# EAGLE design output_8ch_spi_mux (EAGLE 9.2.1)

## Sheet 1 of 2
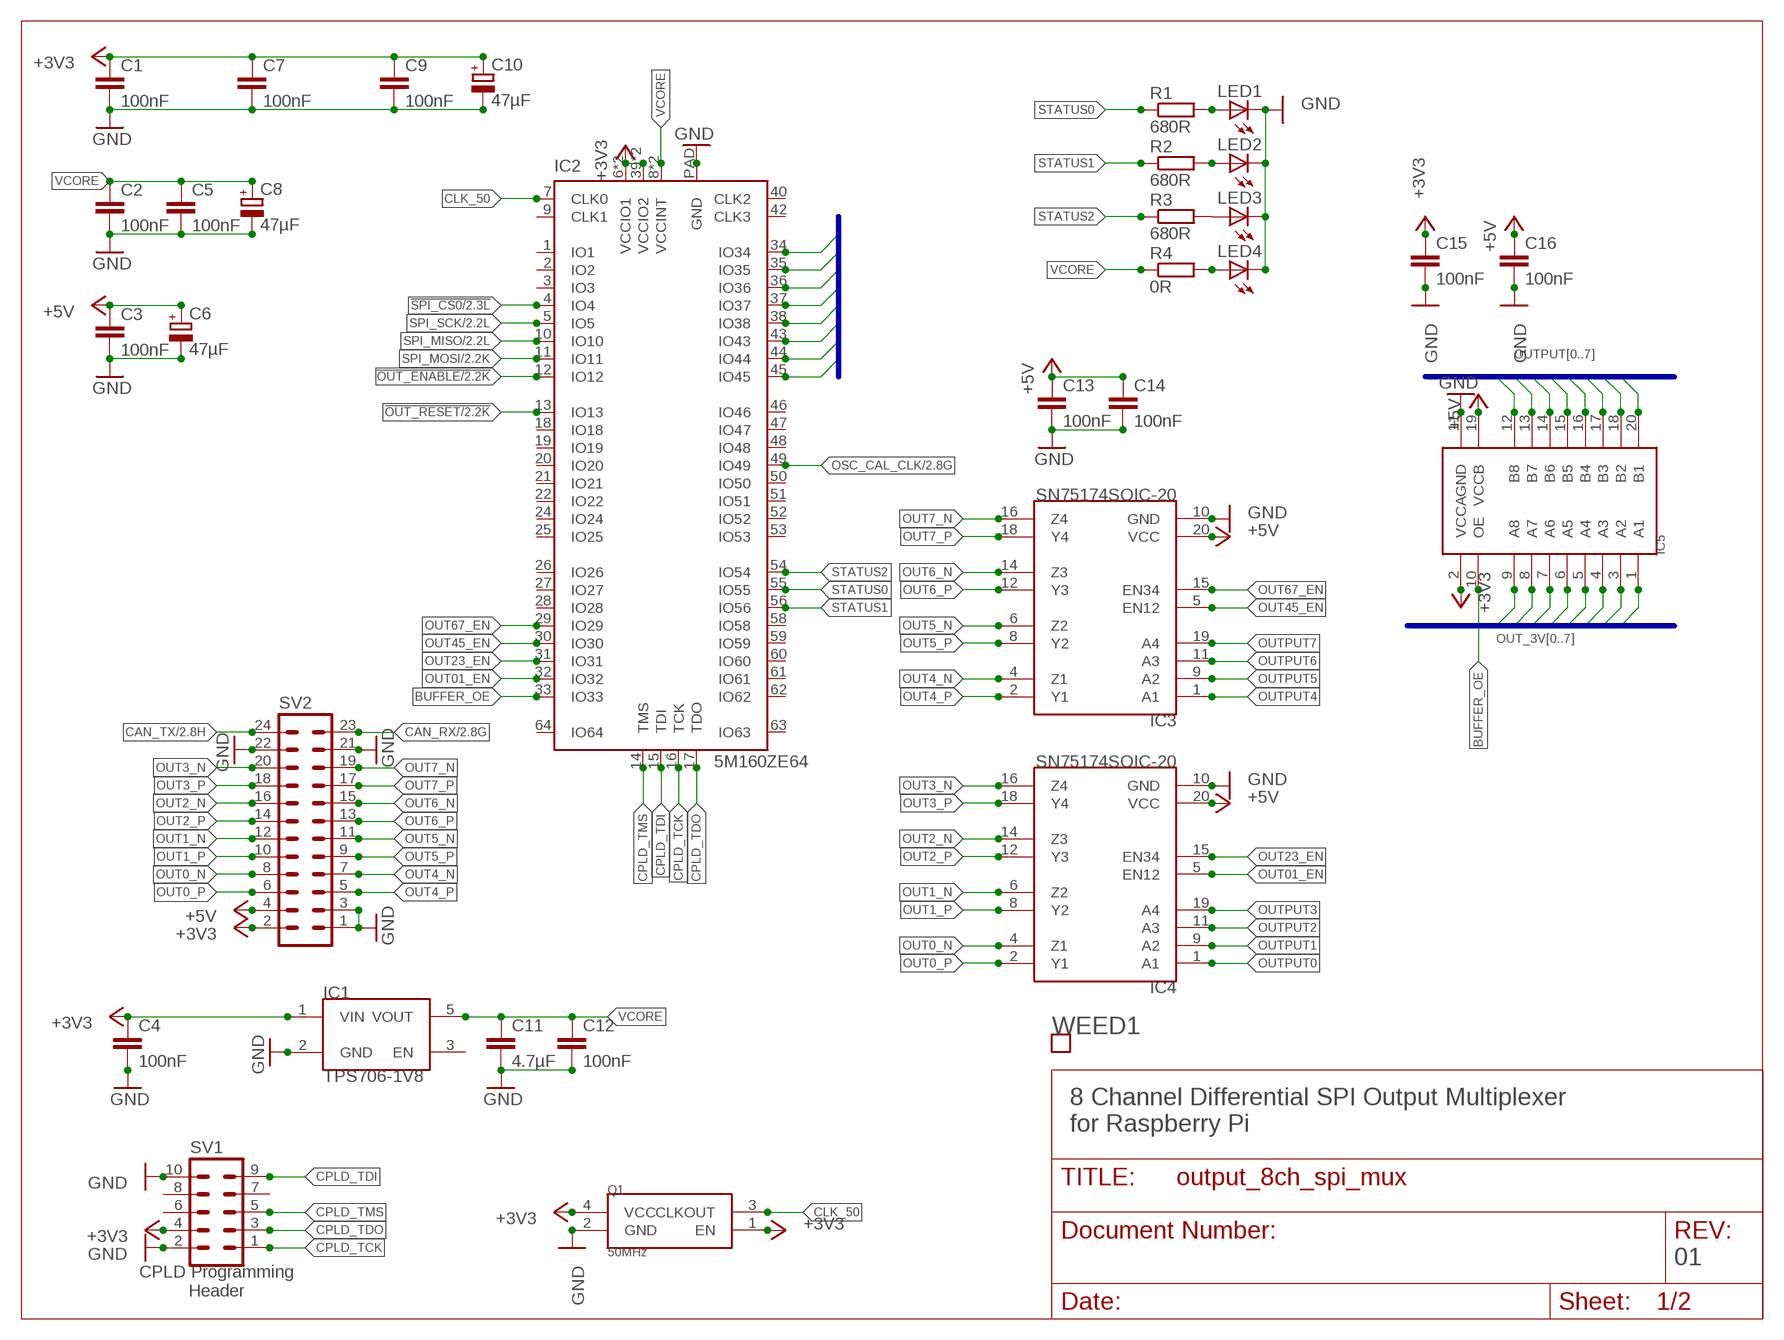
[diagram p0: schematic, sheet 1]

### Parts
C1  100nF  C-EUC0805  [C0805]
C2  100nF  C-EUC0805  [C0805]
C3  100nF  C-EUC0805  [C0805]
C4  100nF  C-EUC0805  [C0805]
C5  100nF  C-EUC0805  [C0805]
C6  47µF  CPOL-EUCT6032  [CT6032]
C7  100nF  C-EUC0805  [C0805]
C8  47µF  CPOL-EUCT6032  [CT6032]
C9  100nF  C-EUC0805  [C0805]
C10  47µF  CPOL-EUCT6032  [CT6032]
C11  4.7µF  C-EUC0805  [C0805]
C12  100nF  C-EUC0805  [C0805]
C13  100nF  C-EUC0805  [C0805]
C14  100nF  C-EUC0805  [C0805]
C15  100nF  C-EUC0805  [C0805]
C16  100nF  C-EUC0805  [C0805]
IC1  TPS706-1V8  TPS706SOT23-5  [SOT23-5]
IC2  5M160ZE64  [EQFP64]
IC3  SN75174SOIC-20  [SOIC20S]
IC4  SN75174SOIC-20  [SOIC20S]
IC5  TXB0108TSSOP20  [TSSOP20]
LED1  LEDCHIPLED_1206  [CHIPLED_1206]
LED2  LEDCHIPLED_1206  [CHIPLED_1206]
LED3  LEDCHIPLED_1206  [CHIPLED_1206]
LED4  LEDCHIPLED_1206  [CHIPLED_1206]
Q1  50MHz  DSC61XX  [VLGA-4]
R1  680R  R-EU_M0805  [M0805]
R2  680R  R-EU_M0805  [M0805]
R3  680R  R-EU_M0805  [M0805]
R4  0R  R-EU_M0805  [M0805]
SV1  MA05-2  [MA05-2]
SV2  MA12-2  [MA12-2]
WEED1  WEED  [DOINK]

### Nets
!OUT_ENABLE: IC2.12(IO12) ; also sheet 2
!OUT_RESET: IC2.13(IO13) ; also sheet 2
!SPI_CS0: IC2.4(IO4) ; also sheet 2
+3V3: C1.1 C4.1 C7.1 C9.1 C10.+ C15.1 IC1.1(VIN) IC2.6(VCCIO1) IC2.23(VCCIO1) IC2.39(VCCIO2) IC2.57(VCCIO2) IC5.2(VCCA) Q1.1(EN) Q1.4(VCC) SV1.4 SV2.2 ; also sheet 2
+5V: C3.1 C6.+ C13.1 C14.1 C16.1 IC3.20(VCC) IC4.20(VCC) IC5.19(VCCB) SV2.4 ; also sheet 2
BUFFER_OE: IC2.33(IO33) IC5.10(OE)
CAN_RX: SV2.23 ; also sheet 2
CAN_TX: SV2.24 ; also sheet 2
CLK_50: IC2.7(CLK0) Q1.3(CLKOUT)
CPLD_TCK: IC2.16(TCK) SV1.1
CPLD_TDI: IC2.15(TDI) SV1.9
CPLD_TDO: IC2.17(TDO) SV1.3
CPLD_TMS: IC2.14(TMS) SV1.5
GND: C1.2 C2.2 C3.2 C4.2 C5.2 C6.- C7.2 C8.- C9.2 C10.- C11.2 C12.2 C13.2 C14.2 C15.2 C16.2 IC1.2(GND) IC2.PAD(GND) IC3.10(GND) IC4.10(GND) IC5.11(GND) LED1.C LED2.C LED3.C LED4.C Q1.2(GND) SV1.2 SV1.10 SV2.1 SV2.3 SV2.21 SV2.22 ; also sheet 2
N$1: LED4.A R4.2
N$2: LED3.A R3.2
N$13: LED1.A R1.2
N$14: LED2.A R2.2
OSC_CAL_CLK: IC2.49(IO49) ; also sheet 2
OUT0_N: IC4.4(Z1) SV2.8
OUT0_P: IC4.2(Y1) SV2.6
OUT01_EN: IC2.32(IO32) IC4.5(EN12)
OUT1_N: IC4.6(Z2) SV2.12
OUT1_P: IC4.8(Y2) SV2.10
OUT2_N: IC4.14(Z3) SV2.16
OUT2_P: IC4.12(Y3) SV2.14
OUT3_N: IC4.16(Z4) SV2.20
OUT3_P: IC4.18(Y4) SV2.18
OUT4_N: IC3.4(Z1) SV2.7
OUT4_P: IC3.2(Y1) SV2.5
OUT5_N: IC3.6(Z2) SV2.11
OUT5_P: IC3.8(Y2) SV2.9
OUT6_N: IC3.14(Z3) SV2.15
OUT6_P: IC3.12(Y3) SV2.13
OUT7_N: IC3.16(Z4) SV2.19
OUT7_P: IC3.18(Y4) SV2.17
OUT23_EN: IC2.31(IO31) IC4.15(EN34)
OUT45_EN: IC2.30(IO30) IC3.5(EN12)
OUT67_EN: IC2.29(IO29) IC3.15(EN34)
OUT_3V0: IC2.45(IO45) IC5.1(A1)
OUT_3V1: IC2.44(IO44) IC5.3(A2)
OUT_3V2: IC2.43(IO43) IC5.4(A3)
OUT_3V3: IC2.38(IO38) IC5.5(A4)
OUT_3V4: IC2.37(IO37) IC5.6(A5)
OUT_3V5: IC2.36(IO36) IC5.7(A6)
OUT_3V6: IC2.35(IO35) IC5.8(A7)
OUT_3V7: IC2.34(IO34) IC5.9(A8)
OUTPUT0: IC4.1(A1) IC5.20(B1)
OUTPUT1: IC4.9(A2) IC5.18(B2)
OUTPUT2: IC4.11(A3) IC5.17(B3)
OUTPUT3: IC4.19(A4) IC5.16(B4)
OUTPUT4: IC3.1(A1) IC5.15(B5)
OUTPUT5: IC3.9(A2) IC5.14(B6)
OUTPUT6: IC3.11(A3) IC5.13(B7)
OUTPUT7: IC3.19(A4) IC5.12(B8)
SPI_MISO: IC2.10(IO10) ; also sheet 2
SPI_MOSI: IC2.11(IO11) ; also sheet 2
SPI_SCK: IC2.5(IO5) ; also sheet 2
STATUS0: IC2.55(IO55) R1.1
STATUS1: IC2.56(IO56) R2.1
STATUS2: IC2.54(IO54) R3.1
VCORE: C2.1 C5.1 C8.+ C11.1 C12.1 IC1.5(VOUT) IC2.8(VCCINT) IC2.41(VCCINT) R4.1
Unconnected: IC1.3(EN) IC2.1(IO1) IC2.2(IO2) IC2.3(IO3) IC2.9(CLK1) IC2.18(IO18) IC2.19(IO19) IC2.20(IO20) IC2.21(IO21) IC2.22(IO22) IC2.24(IO24) IC2.25(IO25) IC2.26(IO26) IC2.27(IO27) IC2.28(IO28) IC2.40(CLK2) IC2.42(CLK3) IC2.46(IO46) IC2.47(IO47) IC2.48(IO48) IC2.50(IO50) IC2.51(IO51) IC2.52(IO52) IC2.53(IO53) IC2.58(IO58) IC2.59(IO59) IC2.60(IO60) IC2.61(IO61) IC2.62(IO62) IC2.63(IO63) IC2.64(IO64) SV1.6 SV1.7 SV1.8

### Buses
OUT_3V[0..7]
OUTPUT[0..7]

### Notes on the sheet
- 8 Channel Differential SPI Output Multiplexer
  for Raspberry Pi
- CPLD Programming
  Header
- 01

## Sheet 2 of 2
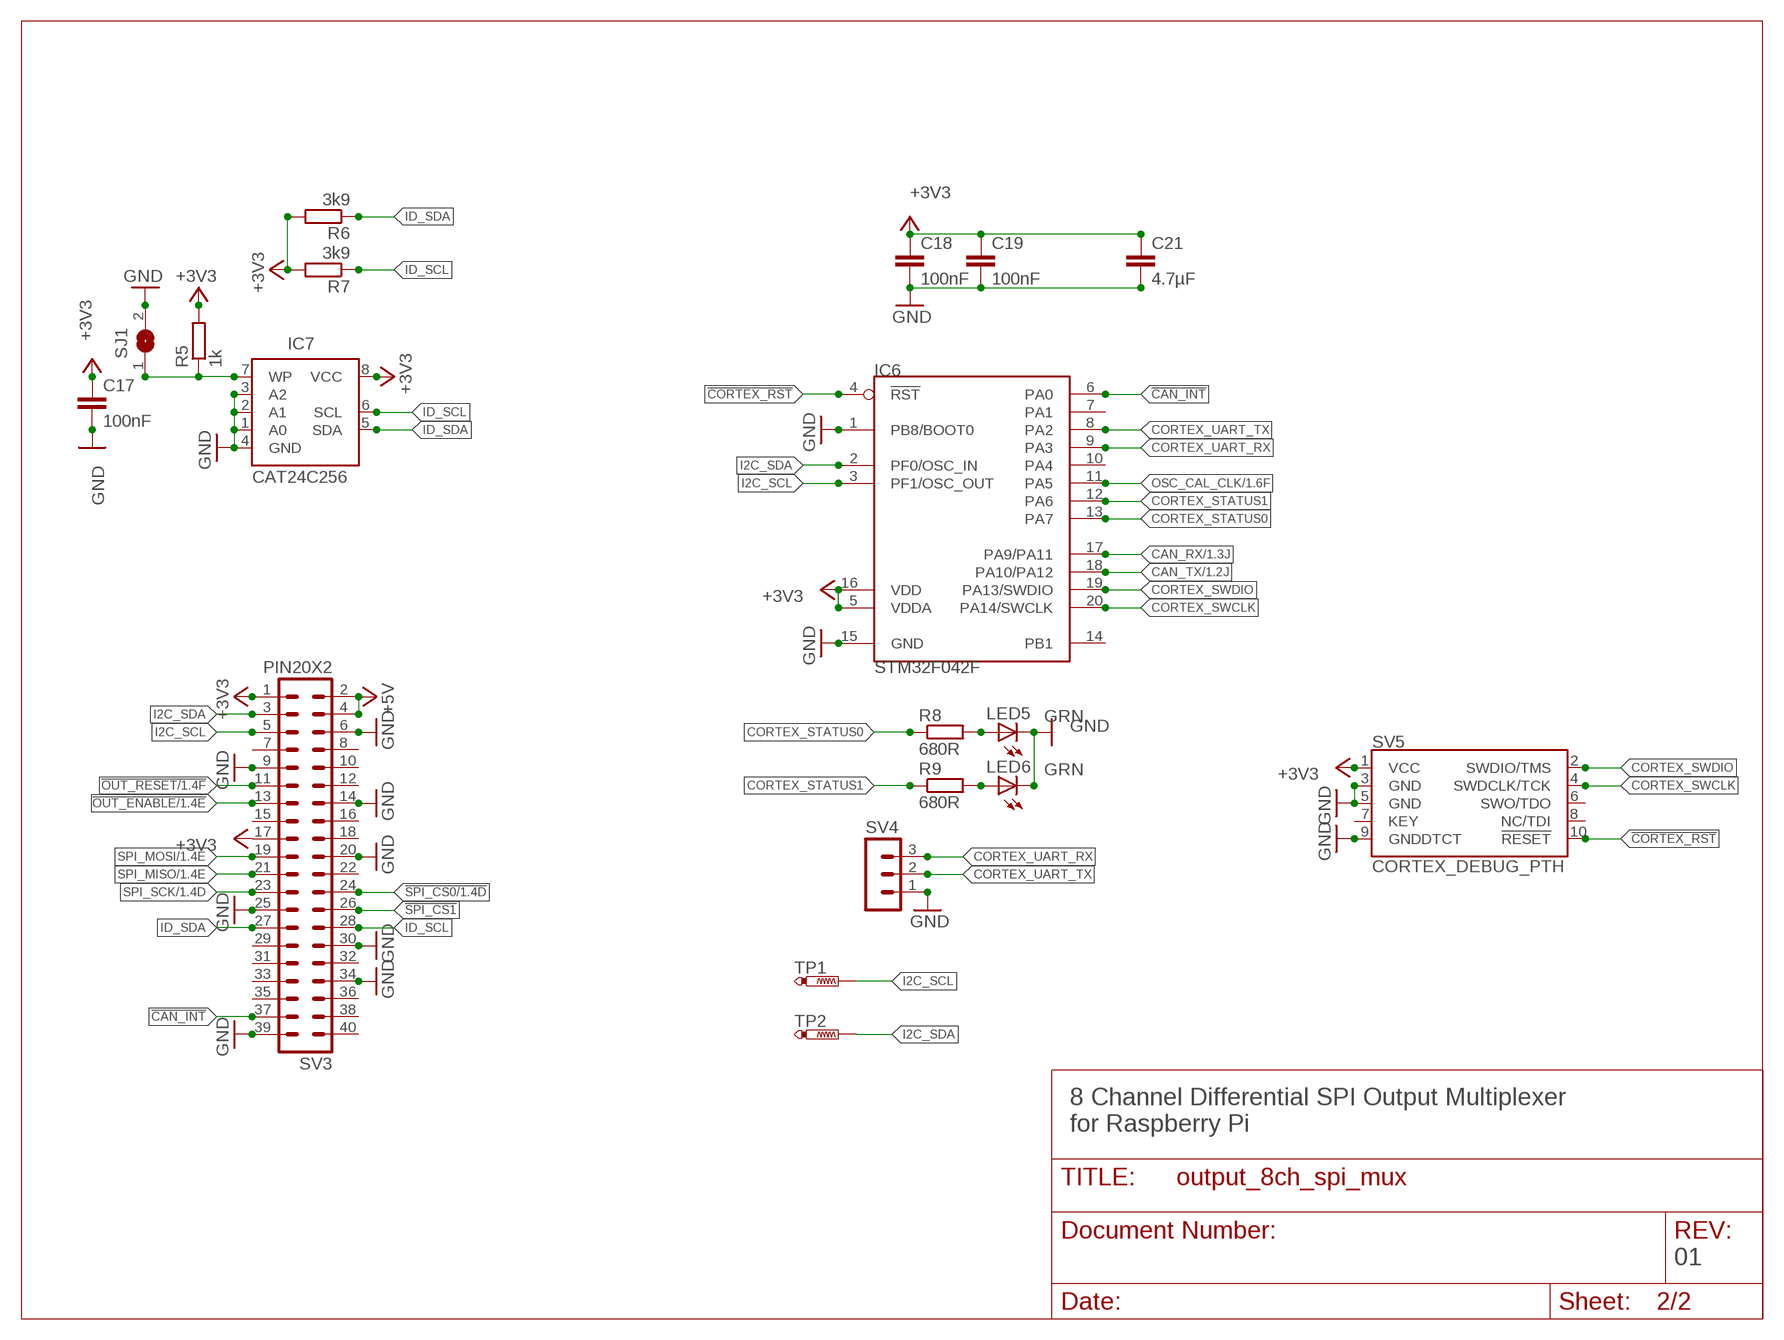
[diagram p1: schematic, sheet 2]

### Parts
C17  100nF  C-EUC0805  [C0805]
C18  100nF  C-EUC0805  [C0805]
C19  100nF  C-EUC0805  [C0805]
C21  4.7µF  C-EUC0805  [C0805]
IC6  STM32F042F  [TSSOP20]
IC7  CAT24C256  EEPROM24  [SOIC8]
LED5  GRN  LEDCHIPLED_1206  [CHIPLED_1206]
LED6  GRN  LEDCHIPLED_1206  [CHIPLED_1206]
R5  1k  R-EU_M0805  [M0805]
R6  3k9  R-EU_M0805  [M0805]
R7  3k9  R-EU_M0805  [M0805]
R8  680R  R-EU_M0805  [M0805]
R9  680R  R-EU_M0805  [M0805]
SJ1  SJ  [SJ]
SV3  PIN20X2  [PIN_20X2]
SV4  MA03-1  [MA03-1]
SV5  CORTEX_DEBUG_PTH  [2X5-PTH-1.27MM]
TP1  PTR1B1,27  [B1,27]
TP2  PTR1B1,27  [B1,27]

### Nets
!CAN_INT: IC6.6(PA0) SV3.37
!CORTEX_RST: IC6.4(!RST) SV5.10(!RESET)
!OUT_ENABLE: SV3.13 ; also sheet 1
!OUT_RESET: SV3.11 ; also sheet 1
!SPI_CS0: SV3.24 ; also sheet 1
!SPI_CS1: SV3.26
+3V3: C17.1 C18.1 C19.1 C21.1 IC6.5(VDDA) IC6.16(VDD) IC7.8(VCC) R5.2 R6.2 R7.2 SV3.1 SV3.17 SV5.1(VCC) ; also sheet 1
+5V: SV3.2 SV3.4 ; also sheet 1
CAN_RX: IC6.17(PA9/PA11) ; also sheet 1
CAN_TX: IC6.18(PA10/PA12) ; also sheet 1
CORTEX_STATUS0: IC6.13(PA7) R8.1
CORTEX_STATUS1: IC6.12(PA6) R9.1
CORTEX_SWCLK: IC6.20(PA14/SWCLK) SV5.4(SWDCLK/TCK)
CORTEX_SWDIO: IC6.19(PA13/SWDIO) SV5.2(SWDIO/TMS)
CORTEX_UART_RX: IC6.9(PA3) SV4.3
CORTEX_UART_TX: IC6.8(PA2) SV4.2
GND: C17.2 C18.2 C19.2 C21.2 IC6.1(PB8/BOOT0) IC6.15(GND) IC7.1(A0) IC7.2(A1) IC7.3(A2) IC7.4(GND) LED5.C LED6.C SJ1.2 SV3.6 SV3.9 SV3.14 SV3.20 SV3.25 SV3.30 SV3.34 SV3.39 SV4.1 SV5.3(GND) SV5.5(GND) SV5.9(GNDDTCT) ; also sheet 1
I2C_SCL: IC6.3(PF1/OSC_OUT) SV3.5 TP1.TP
I2C_SDA: IC6.2(PF0/OSC_IN) SV3.3 TP2.TP
ID_SCL: IC7.6(SCL) R7.1 SV3.28
ID_SDA: IC7.5(SDA) R6.1 SV3.27
N$3: IC7.7(WP) R5.1 SJ1.1
N$4: LED5.A R8.2
N$5: LED6.A R9.2
OSC_CAL_CLK: IC6.11(PA5) ; also sheet 1
SPI_MISO: SV3.21 ; also sheet 1
SPI_MOSI: SV3.19 ; also sheet 1
SPI_SCK: SV3.23 ; also sheet 1
Unconnected: IC6.7(PA1) IC6.10(PA4) IC6.14(PB1) SV3.7 SV3.8 SV3.10 SV3.12 SV3.15 SV3.16 SV3.18 SV3.22 SV3.29 SV3.31 SV3.32 SV3.33 SV3.35 SV3.36 SV3.38 SV3.40 SV5.6(SWO/TDO) SV5.7(KEY) SV5.8(NC/TDI)

### Notes on the sheet
- 8 Channel Differential SPI Output Multiplexer
  for Raspberry Pi
- 01

## Library data of the parts
C1-C5 C7 C9 C12-C19 = rcl:C-EU: CAPACITOR, European symbol; MOUSER: 710-885012207072; SPICEPREFIX: C
C6 C8 C10 = rcl:CPOL-EU: POLARIZED CAPACITOR, European symbol; MOUSER: 581-TAJD476M016RNJV; SPICEPREFIX: C
C11 C21 = rcl:C-EU: CAPACITOR, European symbol; MOUSER: 81-GRM21BR71A475ME1L; SPICEPREFIX: C
IC1 = lichtenstein_onion:TPS706: 1.8V Out, 150-mA, 1-μA IQ Voltage Regulators with Enable Information <http://www.ti.com/product/tps706>; MOUSER: 595-TPS70618DBVT
IC2 = lichtenstein_onion:5M160ZE64: 5M160ZE64 edit this description Auto generated by make-symbol-device-package-bsdl.ulp Rev. 44 Source: 5M160ZE64.bsd; MOUSER: 989-5M160ZE64C5N
IC3 IC4 = lichtenstein_onion:SN75174: Quadruple Differential Line Driver Datasheet <http://www.ti.com/lit/ds/symlink/sn75174.pdf>; MOUSER: 595-SN75174DWR
IC5 = lichtenstein_onion:TXB0108: 8-Bit Bidirectional Voltage-Level Translator with Auto-Direction Sensing and ±15-kV ESD Protection Footprint Proven Datasheet <http://www.ti.com/lit/ds/symlink/txb0108.pdf>; MOUSER: 595-TXB0108PWR
IC6 = lichtenstein_onion:STM32F042F: STM32F042Fx – Mainstream ARM Cortex-M0 USB line MCU with 32 Kbytes Flash, 48 MHz CPU, USB, CAN and CEC functions Datasheet <https://www.st.com/resource/en/datasheet/stm32f042f6.pdf> STM32F042x6 <https://www.st.com/content/st_com/en/products/microcontrollers/stm32-32-bit-arm-cortex-mcus/stm32-mainstream-mcus/stm32f0-series/stm32f0x2/stm32f042f6.html>: 32K flash, 6K SRAM STM32F042x4 <https://www.st.com/content/st_com/en/products/microcontrollers/stm32-32-bit-arm-cortex-mcus/stm32-mainstream-mcus/stm32f0-series/stm32f0x2/stm32f042f4.html>: 16K flash, 6K SRAM; MOUSER: 511-STM32F042F6P6
IC7 = FLYFISH:EEPROM24; MOUSER: 698-CAT24C256WI-GT3
LED1-LED3 LED5 LED6 = led:LED: LED OSRAM: - CHIPLED LG R971, LG N971, LY N971, LG Q971, LY Q971, LO R971, LY R971 LH N974, LH R974 LS Q976, LO Q976, LY Q976 LO Q996 - Hyper CHIPLED LW Q18S LB Q993, LB Q99A, LB R99A - SideLED LS A670, LO A670, LY A670, LG A670, LP A670 LB A673, LV A673, LT A673, LW A673 LH A674 LY A675 LS A676, LA A676, LO A676, LY A676, LW A676 LS A679, LY A679, LG A679 - Hyper Micro SIDELED® LS Y876, LA Y876, LO Y876, LY Y876 LT Y87S - SmartLED LW L88C, LW L88S LB L89C, LB L89S, LG L890 LS L89K, LO L89K, LY L89K LS L896, LA L896, LO L896, LY L896 - TOPLED LS T670, LO T670, LY T670, LG T670, LP T670 LSG T670, LSP T670, LSY T670, LOP T670, LYG T670 LG T671, LOG T671, LSG T671 LB T673, LV T673, LT T673, LW T673 LH T674 LS T676, LA T676, LO T676, LY T676, LB T676, LH T676, LSB T676, LW T676 LB T67C, LV T67C, LT T67C, LS T67K, LO T67K, LY T67K, LW E67C LS E67B, LA E67B, LO E67B, LY E67B, LB E67C, LV E67C, LT E67C LW T67C LS T679, LY T679, LG T679 LS T770, LO T770, LY T770, LG T770, LP T770 LB T773, LV T773, LT T773, LW T773 LH T774 LS E675, LA E675, LY E675, LS T675 LS T776, LA T776, LO T776, LY T776, LB T776 LHGB T686 LT T68C, LB T68C - Hyper Mini TOPLED® LB M676 - Mini TOPLED Santana® LG M470 LS M47K, LO M47K, LY M47K Source: http://www.osram.convergy.de LUXEON: - LUMILED® LXK2-PW12-R00, LXK2-PW12-S00, LXK2-PW14-U00, LXK2-PW14-V00 LXK2-PM12-R00, LXK2-PM12-S00, LXK2-PM14-U00 LXK2-PE12-Q00, LXK2-PE12-R00, LXK2-PE12-S00, LXK2-PE14-T00, LXK2-PE14-U00 LXK2-PB12-K00, LXK2-PB12-L00, LXK2-PB12-M00, LXK2-PB14-N00, LXK2-PB14-P00, LXK2-PB14-Q00 LXK2-PR12-L00, LXK2-PR12-M00, LXK2-PR14-Q00, LXK2-PR14-R00 LXK2-PD12-Q00, LXK2-PD12-R00, LXK2-PD12-S00 LXK2-PH12-R00, LXK2-PH12-S00 LXK2-PL12-P00, LXK2-PL12-Q00, LXK2-PL12-R00 Source: www.luxeon.com KINGBRIGHT: KA-3528ASYC Source: www.kingbright.com; MOUSER: 604-APTR3216SGC
LED4 = led:LED: LED OSRAM: - CHIPLED LG R971, LG N971, LY N971, LG Q971, LY Q971, LO R971, LY R971 LH N974, LH R974 LS Q976, LO Q976, LY Q976 LO Q996 - Hyper CHIPLED LW Q18S LB Q993, LB Q99A, LB R99A - SideLED LS A670, LO A670, LY A670, LG A670, LP A670 LB A673, LV A673, LT A673, LW A673 LH A674 LY A675 LS A676, LA A676, LO A676, LY A676, LW A676 LS A679, LY A679, LG A679 - Hyper Micro SIDELED® LS Y876, LA Y876, LO Y876, LY Y876 LT Y87S - SmartLED LW L88C, LW L88S LB L89C, LB L89S, LG L890 LS L89K, LO L89K, LY L89K LS L896, LA L896, LO L896, LY L896 - TOPLED LS T670, LO T670, LY T670, LG T670, LP T670 LSG T670, LSP T670, LSY T670, LOP T670, LYG T670 LG T671, LOG T671, LSG T671 LB T673, LV T673, LT T673, LW T673 LH T674 LS T676, LA T676, LO T676, LY T676, LB T676, LH T676, LSB T676, LW T676 LB T67C, LV T67C, LT T67C, LS T67K, LO T67K, LY T67K, LW E67C LS E67B, LA E67B, LO E67B, LY E67B, LB E67C, LV E67C, LT E67C LW T67C LS T679, LY T679, LG T679 LS T770, LO T770, LY T770, LG T770, LP T770 LB T773, LV T773, LT T773, LW T773 LH T774 LS E675, LA E675, LY E675, LS T675 LS T776, LA T776, LO T776, LY T776, LB T776 LHGB T686 LT T68C, LB T68C - Hyper Mini TOPLED® LB M676 - Mini TOPLED Santana® LG M470 LS M47K, LO M47K, LY M47K Source: http://www.osram.convergy.de LUXEON: - LUMILED® LXK2-PW12-R00, LXK2-PW12-S00, LXK2-PW14-U00, LXK2-PW14-V00 LXK2-PM12-R00, LXK2-PM12-S00, LXK2-PM14-U00 LXK2-PE12-Q00, LXK2-PE12-R00, LXK2-PE12-S00, LXK2-PE14-T00, LXK2-PE14-U00 LXK2-PB12-K00, LXK2-PB12-L00, LXK2-PB12-M00, LXK2-PB14-N00, LXK2-PB14-P00, LXK2-PB14-Q00 LXK2-PR12-L00, LXK2-PR12-M00, LXK2-PR14-Q00, LXK2-PR14-R00 LXK2-PD12-Q00, LXK2-PD12-R00, LXK2-PD12-S00 LXK2-PH12-R00, LXK2-PH12-S00 LXK2-PL12-P00, LXK2-PL12-Q00, LXK2-PL12-R00 Source: www.luxeon.com KINGBRIGHT: KA-3528ASYC Source: www.kingbright.com; MOUSER: 604-APT3216LSECKJ3RV
Q1 = lichtenstein_onion:DSC61XX: Ultra-Small, Ultra-Low Power MEMS Oscillator Footprint Proven Datasheet <https://www.mouser.com/datasheet/2/268/20005624B-1149202.pdf>; MOUSER: 579-6101JI2A0500000T
R1-R3 R8 R9 = rcl:R-EU_: RESISTOR, European symbol; MOUSER: 652-CR0805-FX6800GLF; SPICEPREFIX: R
R4 = rcl:R-EU_: RESISTOR, European symbol; MOUSER: 71-RCG08050000Z0EA; SPICEPREFIX: R
R5 = rcl:R-EU_: RESISTOR, European symbol; MOUSER: 667-ERJ-6ENF1001V; SPICEPREFIX: R
R6 R7 = rcl:R-EU_: RESISTOR, European symbol; MOUSER: 667-ERJ-6ENF3901V; SPICEPREFIX: R
SJ1 = jumper:SJ: SMD solder JUMPER
SV1 = con-lstb:MA05-2: PIN HEADER; MOUSER: 517-30310-6002; OC_FARNELL: unknown; OC_NEWARK: unknown
SV2 = con-lstb:MA12-2: PIN HEADER; MOUSER: 517-30320-6002; OC_FARNELL: unknown; OC_NEWARK: unknown
SV3 = FLYFISH:PIN20X2
SV4 = con-lstb:MA03-1: PIN HEADER; OC_FARNELL: unknown; OC_NEWARK: unknown
SV5 = lichtenstein_onion:CORTEX_DEBUG: Cortex Debug Connector - 10 pin; MOUSER: 649-221111-00010T4LF
TP1 TP2 = testpad:PTR1: TEST PIN
WEED1 = lichtenstein_onion:WEED

## Board
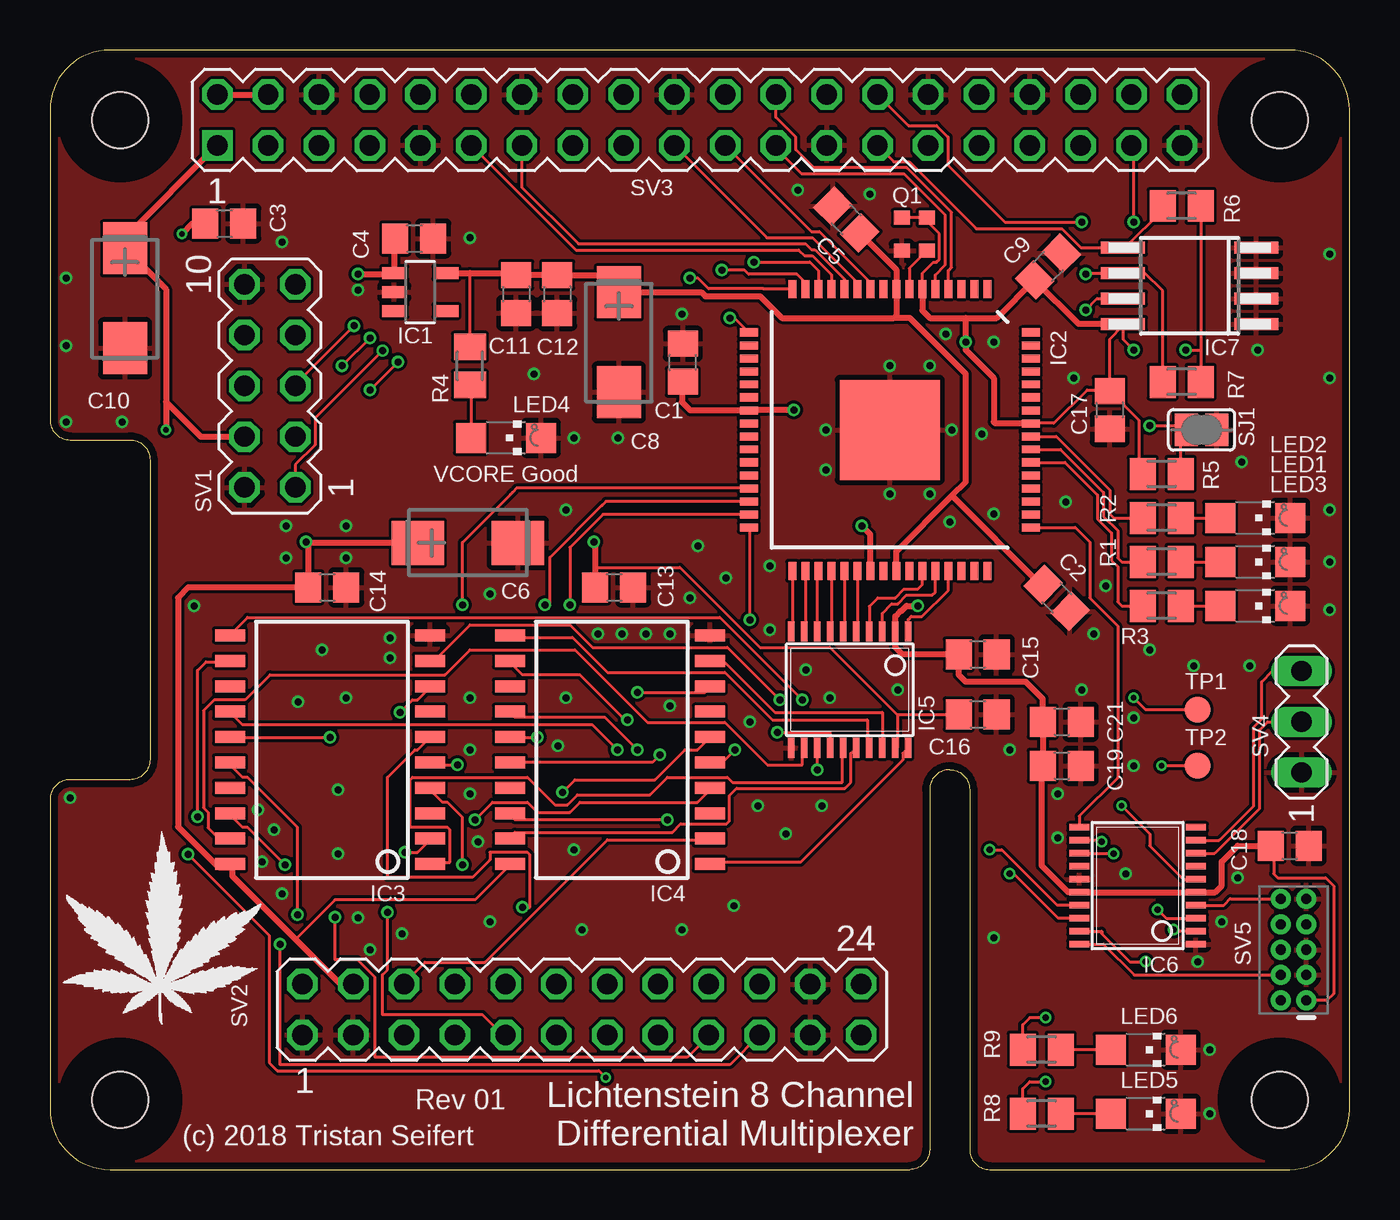
[diagram p2: board, top side]
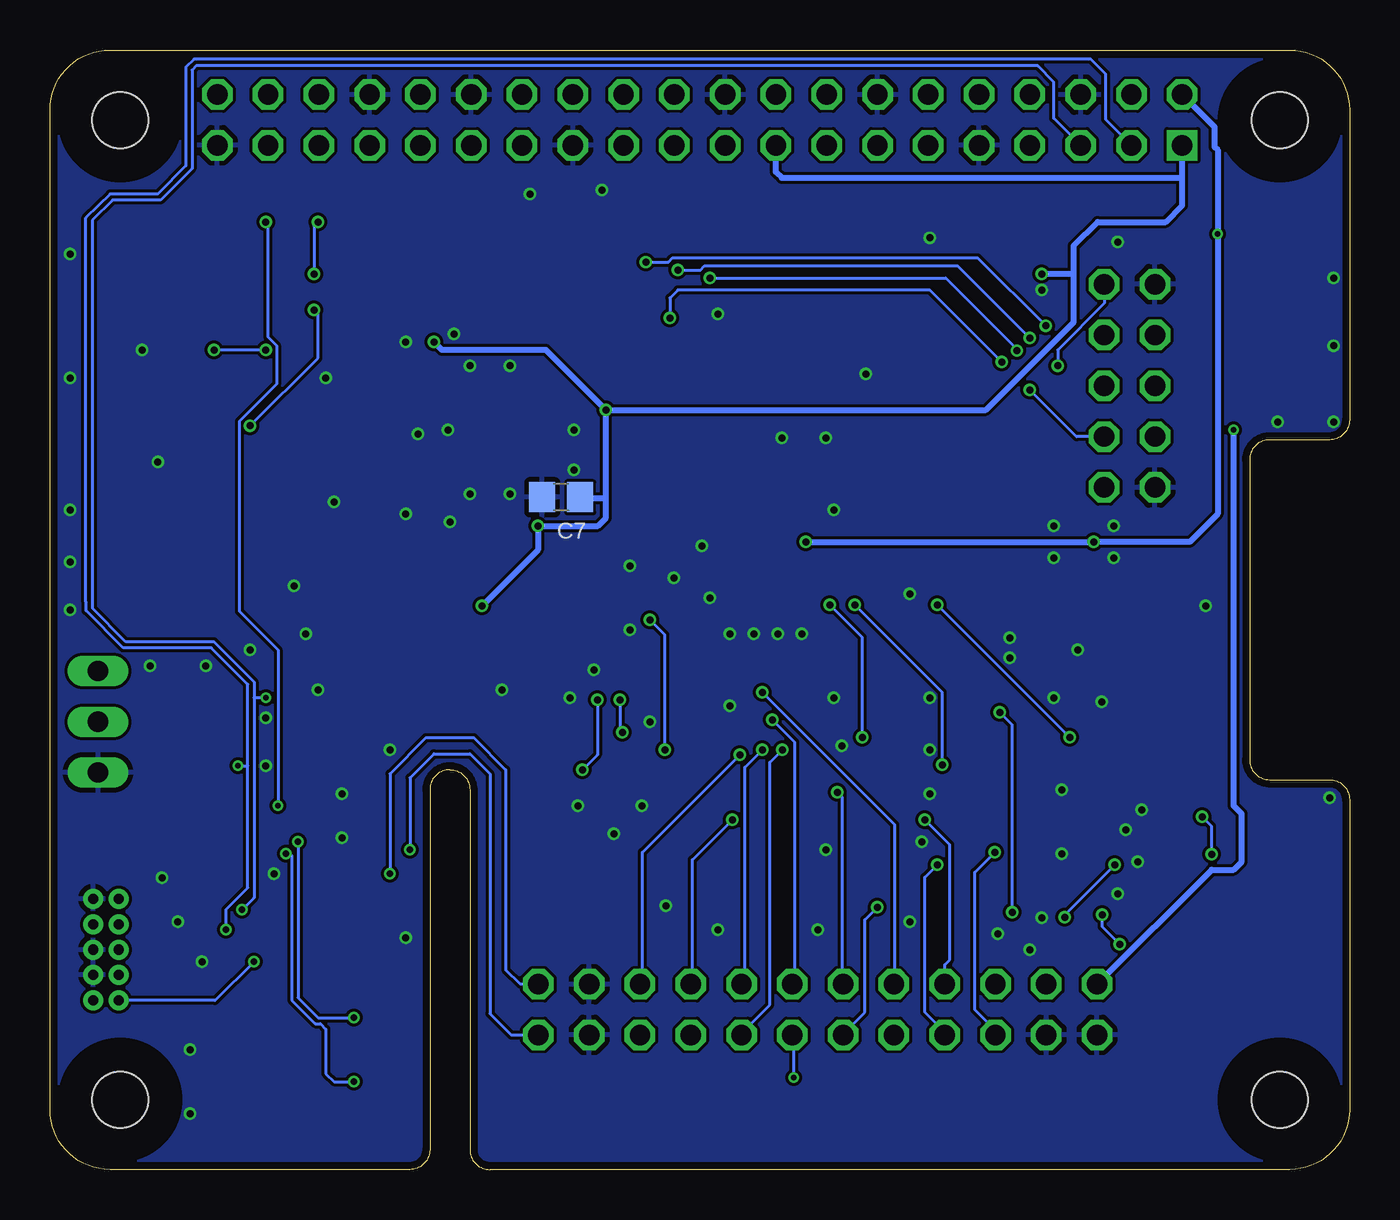
[diagram p3: board, bottom side, seen from below]

Size 65 x 56 mm. Coordinates in mm from the lower left corner, seen from the top.
Outline: 0,3 arc90 3,0 43,0 arc90 44,1 44,19 arc-90 45,20 arc-90 46,19 46,1 arc90 47,0 62,0 arc90 65,3 65,53 arc90 62,56 3,56 arc90 0,53 0,37.5 arc90 1,36.5 4,36.5 arc-90 5,35.5 5,20.5 arc-90 4,19.5 1,19.5 arc90 0,18.5 0,3
Copper layers (1*16): Top 0.035559375mm / dielectric 1.6mm / Bottom 0.035559375mm
Design rules "oshpark-2layer *": minimum track width 6mil, minimum drill 10mil, track to track 6mil, track to pad 6mil, pad to pad 6mil, via to via 6mil, smd to smd 6mil, copper to edge 15mil, drill to drill 6mil, minimum pad ring 5mil, minimum via ring 5mil, stop-mask expansion 2.5mil, vias tented up to drill 0mil, thermal gap 10mil
Holes 2.8 mm at 3.5,3.5 3.5,52.5 61.5,52.5 61.5,3.5
tRestrict: area 1.9,51 to 5,54; area 60,51 to 63,54; area 60,1.9 to 63,5; area 1.9,1.9 to 5,5
bRestrict: area 1.9,1.9 to 5,5; area 1.9,51 to 5,54; area 60,1.9 to 63,5; area 60,51 to 63,54

### Footprints (pad centres in the part's own frame; a part is rotated, then mirrored left to right if it is on the bottom)
C0805 = smd 1.3 x 1.5: 1 -0.95,0; 2 0.95,0
CT6032 = smd 2.6 x 2.2: + -2.5,0; - 2.5,0
SOT23-5 = smd 0.6 x 1.2: 1 -0.95,-1.306; 2 0,-1.306; 3 0.95,-1.306; 4 0.95,1.306; 5 -0.95,1.306
EQFP64 = smd 0.9 x 0.4: 1 -7.05,4.875; 2 -7.05,4.225; 3 -7.05,3.575; 4 -7.05,2.925; 5 -7.05,2.275; 6 -7.05,1.625; 7 -7.05,0.975; 8 -7.05,0.325; 9 -7.05,-0.325; 10 -7.05,-0.975; 11 -7.05,-1.625; 12 -7.05,-2.275; 13 -7.05,-2.925; 14 -7.05,-3.575; 15 -7.05,-4.225; 16 -7.05,-4.875; 33 7.05,-4.875; 34 7.05,-4.225; 35 7.05,-3.575; 36 7.05,-2.925; 37 7.05,-2.275; 38 7.05,-1.625; 39 7.05,-0.975; 40 7.05,-0.325; 41 7.05,0.325; 42 7.05,0.975; 43 7.05,1.625; 44 7.05,2.275; 45 7.05,2.925; 46 7.05,3.575; 47 7.05,4.225; 48 7.05,4.875 | smd 0.4 x 0.9: 17 -4.875,-7.05; 18 -4.225,-7.05; 19 -3.575,-7.05; 20 -2.925,-7.05; 21 -2.275,-7.05; 22 -1.625,-7.05; 23 -0.975,-7.05; 24 -0.325,-7.05; 25 0.325,-7.05; 26 0.975,-7.05; 27 1.625,-7.05; 28 2.275,-7.05; 29 2.925,-7.05; 30 3.575,-7.05; 31 4.225,-7.05; 32 4.875,-7.05; 49 4.875,7.05; 50 4.225,7.05; 51 3.575,7.05; 52 2.925,7.05; 53 2.275,7.05; 54 1.625,7.05; 55 0.975,7.05; 56 0.325,7.05; 57 -0.325,7.05; 58 -0.975,7.05; 59 -1.625,7.05; 60 -2.275,7.05; 61 -2.925,7.05; 62 -3.575,7.05; 63 -4.225,7.05; 64 -4.875,7.05 | smd 5 x 5: PAD 0,0
SOIC20S = smd 0.6 x 1.5: 1 -5.715,-5; 2 -4.445,-5; 3 -3.175,-5; 4 -1.905,-5; 5 -0.635,-5; 6 0.635,-5; 7 1.905,-5; 8 3.175,-5; 9 4.445,-5; 10 5.715,-5; 11 5.715,5; 12 4.445,5; 13 3.175,5; 14 1.905,5; 15 0.635,5; 16 -0.635,5; 17 -1.905,5; 18 -3.175,5; 19 -4.445,5; 20 -5.715,5
TSSOP20 = smd 0.305 x 0.991: 1 -2.925,-2.918; 2 -2.275,-2.918; 3 -1.625,-2.918; 4 -0.975,-2.918; 5 -0.325,-2.918; 6 0.325,-2.918; 7 0.975,-2.918; 8 1.625,-2.918; 9 2.275,-2.918; 10 2.925,-2.918; 11 2.925,2.918; 12 2.275,2.918; 13 1.625,2.918; 14 0.975,2.918; 15 0.325,2.918; 16 -0.325,2.918; 17 -0.975,2.918; 18 -1.625,2.918; 19 -2.275,2.918; 20 -2.925,2.918
SOIC8 = smd 0.6 x 2.2: 1 -1.905,-3.33; 2 -0.635,-3.33; 3 0.635,-3.33; 4 1.905,-3.33; 5 1.905,3.33; 6 0.635,3.33; 7 -0.635,3.33; 8 -1.905,3.33
CHIPLED_1206 = smd 1.5 x 1.5: A 0,-1.75; C 0,1.75
VLGA-4 = smd 0.7 x 0.8: 1 0,-1.25; 2 1.65,-1.25; 3 1.65,0; 4 0,0
M0805 = smd 1.3 x 1.6: 1 -0.95,0; 2 0.95,0
SJ = smd 1.168 x 1.6: 1 -0.762,0; 2 0.762,0
MA05-2 = drill 1.016 octagon: 1 -5.08,-1.27; 2 -5.08,1.27; 3 -2.54,-1.27; 4 -2.54,1.27; 5 0,-1.27; 6 0,1.27; 7 2.54,-1.27; 8 2.54,1.27; 9 5.08,-1.27; 10 5.08,1.27
MA12-2 = drill 1.016 octagon: 1 -13.97,-1.27; 2 -13.97,1.27; 3 -11.43,-1.27; 4 -11.43,1.27; 5 -8.89,-1.27; 6 -8.89,1.27; 7 -6.35,-1.27; 8 -6.35,1.27; 9 -3.81,-1.27; 10 -3.81,1.27; 11 -1.27,-1.27; 12 -1.27,1.27; 13 1.27,-1.27; 14 1.27,1.27; 15 3.81,-1.27; 16 3.81,1.27; 17 6.35,-1.27; 18 6.35,1.27; 19 8.89,-1.27; 20 8.89,1.27; 21 11.43,-1.27; 22 11.43,1.27; 23 13.97,-1.27; 24 13.97,1.27
PIN_20X2 = drill 1.016 square: 1 -24.13,-1.27 | drill 1.016 octagon: 2 -24.13,1.27; 3 -21.59,-1.27; 4 -21.59,1.27; 5 -19.05,-1.27; 6 -19.05,1.27; 7 -16.51,-1.27; 8 -16.51,1.27; 9 -13.97,-1.27; 10 -13.97,1.27; 11 -11.43,-1.27; 12 -11.43,1.27; 13 -8.89,-1.27; 14 -8.89,1.27; 15 -6.35,-1.27; 16 -6.35,1.27; 17 -3.81,-1.27; 18 -3.81,1.27; 19 -1.27,-1.27; 20 -1.27,1.27; 21 1.27,-1.27; 22 1.27,1.27; 23 3.81,-1.27; 24 3.81,1.27; 25 6.35,-1.27; 26 6.35,1.27; 27 8.89,-1.27; 28 8.89,1.27; 29 11.43,-1.27; 30 11.43,1.27; 31 13.97,-1.27; 32 13.97,1.27; 33 16.51,-1.27; 34 16.51,1.27; 35 19.05,-1.27; 36 19.05,1.27; 37 21.59,-1.27; 38 21.59,1.27; 39 24.13,-1.27; 40 24.13,1.27
MA03-1 = drill 1.016 long: 1 -2.54,0; 2 0,0; 3 2.54,0
2X5-PTH-1.27MM = drill 0.508 pad 1: 1 -2.54,-0.635; 2 -2.54,0.635; 3 -1.27,-0.635; 4 -1.27,0.635; 5 0,-0.635; 6 0,0.635; 7 1.27,-0.635; 8 1.27,0.635; 9 2.54,-0.635; 10 2.54,0.635
B1,27 = smd 1.27 x 1.27: TP 0,0

### Placement (x,y rotation side)
C1  31.65,40.36 90 top
C2  50.35,28.59 315 top
C3  8.72,47.32 0 top
C4  18.22,46.57 0 top
C5  39.83,47.52 135 top
C6  20.9,31.35 0 top
C7  39.43,33.63 180 bottom
C8  28.46,41.38 270 top
C9  49.92,45.17 45 top
C10  3.75,43.58 270 top
C11  23.32,43.8 270 top
C12  25.37,43.8 270 top
C13  28.22,29.12 0 top
C14  13.87,29.12 0 top
C15  46.4,25.77 0 top
C16  46.4,22.77 0 top
C17  53,38 270 top
C18  62,16.2 0 top
C19  50.6,20.2 0 top
C21  50.6,22.4 0 top
IC1  18.52,43.89 270 top
IC2  42,37 270 top
IC3  14,21 90 top
IC4  28,21 90 top
IC5  40,24 180 top
IC6  54.4,14.2 90 top
IC7  57,44.2 90 top
LED1  60.28,30.4 270 top
LED2  60.28,32.6 270 top
LED3  60.28,28.2 270 top
LED4  22.8,36.6 270 top
LED5  54.8,2.8 270 top
LED6  54.8,6 270 top
Q1  43.85,47.61 270 top
R1  55.6,30.4 0 top
R2  55.6,32.6 0 top
R3  55.6,28.2 0 top
R4  21,40.2 270 top
R5  55.6,34.8 180 top
R6  56.6,48.2 0 top
R7  56.6,39.4 0 top
R8  49.6,2.8 0 top
R9  49.6,6 0 top
SJ1  57.6,37 0 top
SV1  11,39.2 90 top
SV2  26.6,8 0 top
SV3  32.5,52.5 0 top
SV4  62.6,22.4 90 top
SV5  62.2,11 90 top
TP1  57.4,23 0 top
TP2  57.4,20.2 0 top
WEED1  0.63,7.19 0 top

### Tracks (layer width: path | path; a pad name or v marks a point on that pad's centre or on a via)
!CAN_INT  (via drill 0.25, 0.35)
  Top 0.152: v54.2,47.4 54.2,51.12 SV3.37 | IC6.6 56.67,14.53 55,16.2 55,16.8 v53.6,18.2
  Bottom 0.152: v54.2,47.4 54.09,47.29 54.09,41.64 53.67,41.22 53.67,39.28 55.53,37.42 55.53,27.93 53.6,26 v53.6,18.2
!CORTEX_RST
  Top 0.152: IC6.4 58.72,13.22 59.05,13.55 59.06,13.54 SV5.10
!OUT_ENABLE
  Top 0.152: SV3.13 23.61,49.12 26.43,46.3 37.79,46.3 38.09,46.01 38.25,46.01 39.73,44.54 IC2.12
!OUT_RESET
  Top 0.152: SV3.11 26.3,46 37.45,46 37.74,45.7 38.13,45.7 39.08,44.76 IC2.13
!SPI_CS0
  Top 0.152: IC2.4 44.92,44.97 45.09,45.13 45.09,47.88 42.86,50.1 38.2,50.1 37.3,51 37.3,51.64 36.31,52.63 SV3.24
+3V3  (via drill 0.25, 0.35)
  Top 0.152: R6.2 57.55,41 | 57.55,41 R7.2 | IC7.8 53.67,42.2 | 53.67,42.2 53.67,41.53 v54.2,41 | v56.8,41 57.55,41 | 53,39 C17.1 54.45,37.5 54.45,35 R5.2 | 53,39 53,41.53 53.67,42.2 | IC2.57 50.2,37.33 51.88,39 53,39 | Q1.1 Q1.4 43.85,47.43 44.48,46.8 44.48,45.52 44.34,45.38 44.18,45.38 43.62,44.83 IC2.6 | 49.62,20.18 C19.1 | C18.1 61.2,16.05 61.2,14.8 61.4,14.6 63.8,14.6 64.2,14.2 64.2,8.8 63.86,8.46 SV5.1
  Top 0.305: SV3.1 3.75,46.61 C10.+ 5.8,44.03 5.8,38.4 | IC2.6 43.62,42.98 44,42.6 45.8,42.6 | 45.8,42.6 47.35,42.6 C9.1 51.45,42.3 IC7.8 | v37.2,38 34.98,38 IC2.23 32.02,37.98 31.6,38.4 31.6,39.36 C1.1 | IC2.39 41.02,31.77 v40.6,32.2 | 45.8,42.6 v45.8,41.4 45.8,41 47.2,39.6 47.2,37.4 47.27,37.33 IC2.57 | 5.8,38.4 7.54,36.66 SV1.4 | 5.8,38.4 v5.8,37 | C18.1 59.4,16.2 58.6,15.4 58.6,14.2 58.27,13.88 IC6.5 IC6.16 50.92,13.88 49.6,15.2 49.6,20.15 49.62,20.18 | v43.4,28.2 42.84,28.2 42.56,27.91 42.51,27.91 42.27,27.68 IC5.2 42.27,26.12 42.63,25.77 C15.1 45.45,24.75 45.8,24.4 48.8,24.4 49.65,23.55 C21.1 C19.1 | v15.4,44.8 17.18,44.8 IC1.1 17.22,46.52 C4.1
  Bottom 0.152: v54.2,41 v56.8,41
  Bottom 0.305: 37.2,33.6 37.2,32.6 37.6,32.2 v40.6,32.2 40.6,31 v43.4,28.2 | 37.2,33.6 v37.2,38 | v37.2,38 40.2,41 45.4,41 v45.8,41.4 | C7.1 38.45,33.6 37.2,33.6 | SV2.2 6.9,15 5.8,15 5.4,15.4 5.4,17.8 5.8,18.2 v5.8,37 | 13.8,44.8 13.8,42.4 18.2,38 v37.2,38 | 13.8,44.8 13.8,46.2 12.6,47.4 9.2,47.4 8.37,48.23 8.37,49.6 | 8.37,49.6 SV3.1 | 13.8,44.8 v15.4,44.8 | SV3.17 28.69,49.89 28.4,49.6 8.37,49.6
+5V  (via drill 0.25, 0.35)
  Top 0.152: 9.12,15.12 9,15.25 IC3.20 | IC4.20 23,15.25 21.25,13.5 14.25,13.5 12.35,11.6 12.2,11.6 | 42.38,22.75 42.38,21.12 IC5.19 | 42.38,22.75 45.38,22.75 C16.1 | 42.38,22.75 39,26.12 35.5,26.12 31.5,30.12 27.27,30.12
  Top 0.305: SV3.2 SV3.4 | v27.2,31.4 27.27,31.33 27.27,30.12 C13.1 | SV2.4 14.53,9.27 12.2,11.6 9.12,14.68 9.12,15.12 8.43,15.12 6.4,17.15 6.4,28.6 6.92,29.12 C14.1 12.92,31.28 v12.8,31.4 12.85,31.35 C6.+ | C3.1 7.12,47.32 v6.6,46.8
  Bottom 0.305: SV3.2 6.75,52.15 6.75,51.15 6.6,51 v6.6,46.8 6.6,32.8 8,31.4 v12.8,31.4 v27.2,31.4
BUFFER_OE
  Top 0.152: IC2.33 37.12,26.97 IC5.10
CAN_RX  (via drill 0.3)
  Top 0.152: IC6.17 50.38,13.22 47.6,16 v47,16
  Bottom 0.152: SV2.23 41.93,6.73 43,7.8 43,19.8 44,20.8 45.8,20.8 47,19.6 v47,16
CAN_TX  (via drill 0.3)
  Top 0.152: IC6.18 50.42,12.57 48.2,14.8 v48,14.8
  Bottom 0.152: SV2.24 41.47,9.27 42.2,10 42.2,20 43.8,21.6 46.2,21.6 48,19.8 v48,14.8
CLK_50
  Top 0.152: Q1.3 42.98,45.09 IC2.7
CORTEX_STATUS0  (via drill 0.3)
  Top 0.152: R8.1 48.65,4.05 49,4.4 v49.8,4.4 | v53.2,15.8 51.51,15.8 IC6.13
  Bottom 0.152: v53.2,15.8 53,15.8 52.91,15.71 52.91,8.47 51.73,7.29 51.47,7.29 51.2,7.02 51.2,4.8 50.8,4.4 v49.8,4.4
CORTEX_STATUS1  (via drill 0.3)
  Top 0.152: R9.1 48.65,7.25 49,7.6 v49.8,7.6 | v52.6,16.4 52.52,16.48 IC6.12
  Bottom 0.152: v52.6,16.4 52.6,8.6 51.6,7.6 v49.8,7.6
CORTEX_SWCLK
  Top 0.152: SV5.4 54.23,9.73 54.23,9.74 52.69,11.28 IC6.20
CORTEX_SWDIO  (via drill 0.3)
  Top 0.152: v54.8,10.4 54,10.4 52.6,11.8 52.6,11.93 IC6.19
  Bottom 0.152: v54.8,10.4 56.74,8.46 SV5.2
CORTEX_UART_RX
  Top 0.152: IC6.9 58.48,16.48 60.2,18.2 60.2,22.13 60.6,22.53 60.6,24.4 61.14,24.94 SV4.3
CORTEX_UART_TX
  Top 0.152: IC6.8 58.26,15.82 60.51,18.07 60.51,22 60.91,22.4 SV4.2
CPLD_TCK  (via drill 0.35)
  Top 0.152: IC2.16 35.69,44.05 35.68,44.06 32.94,44.06 32.4,44.6 v32,44.6 | v16.64,40.96 13.26,37.58 13.26,36.25 12.27,35.26 SV1.1
  Bottom 0.152: v32,44.6 20.2,44.6 16.56,40.96 v16.64,40.96
CPLD_TDI  (via drill 0.35)
  Top 0.152: v33.6,45 34.73,45 34.95,44.79 37.36,44.79 37.77,44.37 IC2.15 | v16,41.6 v14.6,40.2
  Bottom 0.152: v33.6,45 32.46,45 32.25,45.21 19.61,45.21 v16,41.6 | SV1.9 12.27,43.33 14.6,41 v14.6,40.2
CPLD_TDO  (via drill 0.35)
  Top 0.152: v16,39 v17.4,40.4 | v34,42.6 34.23,42.6 IC2.17
  Bottom 0.152: SV1.3 13.66,36.66 v16,39 | v17.4,40.4 21,44 33.6,44 34,43.6 v34,42.6
CPLD_TMS  (via drill 0.35)
  Top 0.152: v35.2,45.39 v35.2,45.4 38,45.4 38.42,44.98 IC2.14 | v15.2,42.2 12.27,39.27 SV1.5
  Bottom 0.152: v35.2,45.39 34.06,45.39 33.85,45.61 18.61,45.61 v15.2,42.2
GND  (via drill 0.35)
  other vias: 44,40.2 44,33.8 38.8,35 38.8,37 42,33.8 42,40.2 51.2,39.6 47.2,41.4 46.6,36.8 47.2,32.8 45,32.4 14.4,19 14.8,23.6 38.6,18.2 35.4,18.2 14.4,15.8 12.4,23.4 13.6,26 34.2,13.2 31.6,12 26.6,12 32,28.6 35,22.4 31,23.2 31,26.8 28.6,26.8 21,23.6 25.8,23.6 21,21 25.4,21.2 21,18.8 21.4,16.4 26.2,16 22,12.4 17.6,11.8 16,11 15.4,12.6 11.2,17 10.4,18 11.6,13.8 10.6,15.4 37.8,25 42.4,24 39,23.6 36,27 17,26.6 29.8,26.8 17,25.6 36.8,16.8 33.8,29.6 32.4,31.2 36,30.2 28.4,36.6 26.2,36.6 25.8,33 21,46.6 15.4,44 59.6,35.4 60,25.2 64,30.4 64,45.8 60.4,41 64,33 64,28 64,39.6 58,6 58,2.8 57.2,25.2 47.2,11.6 50.4,16.6 50.4,18.8 54.2,22.6 53.8,14.8 54.2,20.2 55,26 59.4,14.6 58.6,12.4 57.4,10.4 52.2,26.8 48,21 14.8,30.6 22,28.8 14.8,32.2 11.8,32.2 11.8,30.6 7.2,28.2 27.4,26.8 50.8,33.4 52.8,29.2 45.1,37 44.8,41.8 31.6,42.8 41,48.8 37.4,49 0.8,41.2 0.8,37.4 3.6,37.4 0.8,44.6 1,18.6 11.6,46.4 24.2,39.8 51.6,24
  pour Bottom: 0,0 0,56 65,56 65,0
  pour Top: 0,0 0,56 65,56 65,0
I2C_SCL  (via drill 0.25, 0.3)
  Top 0.152: v55.4,13 55.83,12.57 IC6.3 | TP1.TP 54.8,23 v54.2,23.6
  Bottom 0.152: SV3.5 14.8,52.58 14.8,54.4 15.6,55.2 57.7,55.2 57.9,55 57.9,50.07 59.47,48.49 61.87,48.49 62.88,47.48 62.88,28.08 61.2,26.4 56.8,26.4 54.8,24.4 54.8,23.6 | v55.4,13 54.8,13.6 54.8,23.6 | v54.2,23.6 54.8,23.6
I2C_SDA  (via drill 0.25, 0.3)
  Top 0.152: IC6.2 56.27,11.93 v56.2,12 | TP2.TP v55.6,20.2
  Bottom 0.152: SV3.3 12.2,52.52 12.2,54.8 12.94,55.54 57.8,55.54 58.2,55.14 58.2,50.2 59.6,48.8 62,48.8 63.2,47.6 63.2,28.4 63.19,28.39 63.19,27.96 61.33,26.09 56.93,26.09 55.1,24.27 55.1,20.2 | v56.2,12 56.2,13 55.1,14.1 55.1,20.2 | v55.6,20.2 55.1,20.2
ID_SCL  (via drill 0.35)
  Top 0.152: R7.1 55.65,43.95 54.77,44.84 54.2,44.84 | 54.2,44.84 IC7.6 | v51.6,47.4 47.76,47.4 44.92,50.24 44.92,51.64 44.34,52.22 42.94,52.22 SV3.28 | v51.8,44.8 51.84,44.84 54.2,44.84
  Bottom 0.152: v51.6,47.4 51.8,47.2 v51.8,44.8
ID_SDA
  Top 0.152: SV3.27 42.21,50.41 42.99,50.41 46.34,47.06 50.62,47.06 51.57,46.1 IC7.5 53.76,46.1 55.65,48 R6.1
N$1
  Top 0.152: R4.2 21.05,39.2 LED4.A
N$2
  Top 0.152: R3.2 LED3.A
N$3  (via drill 0.35)
  Top 0.152: SJ1.1 56.82,37.02 | 56.82,37.02 56.64,37.2 v55,37.2 | v51.8,43 52.37,43.56 IC7.7 | R5.1 56.55,36.75 56.82,37.02
  Bottom 0.152: v55,37.2 51.6,40.6 51.6,43 v51.8,43
N$4
  Top 0.152: LED5.A R8.2
N$5
  Top 0.152: LED6.A R9.2
N$13
  Top 0.152: R1.2 LED1.A
N$14
  Top 0.152: R2.2 LED2.A
OSC_CAL_CLK
  Top 0.152: IC2.49 51.27,32.12 52,31.4 52,28.6 53.4,27.2 53.4,19.6 51.48,17.68 IC6.11
OUT0_N  (via drill 0.35)
  Top 0.152: v21.25,17.5 22.12,18.38 23.88,18.38 24.38,17.88 26,17.88 26.5,18.38 32.38,18.38 33,19 IC4.4
  Bottom 0.152: v21.25,17.5 20,16.25 20,10.5 20.25,10.25 SV2.8
OUT0_P
  Top 0.152: IC4.2 33,16.5 27.88,16.5 21.75,10.38 18.75,10.38 17.71,9.34 SV2.6
OUT01_EN  (via drill 0.35)
  Top 0.152: v35,27.5 35,32.12 IC2.32 | v34.25,21 33.62,20.38 33,20.38 IC4.5
  Bottom 0.152: v35,27.5 34.25,26.75 v34.25,21
OUT1_N  (via drill 0.35)
  Top 0.152: v25.62,18.88 26.25,19.5 30.25,19.5 31.75,21 32.38,21 33,21.62 IC4.6
  Bottom 0.152: v25.62,18.88 25.38,18.62 25.38,9.27 SV2.12
OUT1_P  (via drill 0.35)
  Top 0.152: v29.38,23.88 32.75,23.88 33,24.12 IC4.8
  Bottom 0.152: v29.38,23.88 22.75,17.25 22.75,9.27 SV2.10
OUT2_N  (via drill 0.35)
  Top 0.152: v29.38,21 27.75,22.62 23.25,22.62 23,22.88 IC4.14
  Bottom 0.152: v29.38,21 30.25,20.12 30.25,9.28 SV2.16
OUT2_P  (via drill 0.35)
  Top 0.152: v28.88,22.5 28.75,22.5 26.5,24.75 23.62,24.75 23,25.38 IC4.12
  Bottom 0.152: v28.88,22.5 27.75,21.38 27.75,9.28 SV2.14
OUT3_N  (via drill 0.35)
  Top 0.152: v30.5,20.75 30.12,20.38 23,20.38 IC4.16
  Bottom 0.152: v30.5,20.75 35.38,15.88 35.38,9.28 SV2.20
OUT3_P  (via drill 0.35)
  Top 0.152: v30.88,17.5 23.25,17.5 23,17.75 IC4.18
  Bottom 0.152: v30.88,17.5 32.88,15.5 32.88,9.27 SV2.18
OUT4_N  (via drill 0.35)
  Top 0.152: v20.62,15.25 20.62,17.62 19.88,18.38 19.62,18.38 19,19 IC3.4
  Bottom 0.152: v20.62,15.25 21.25,14.62 21.25,7.88 20.25,6.88 SV2.7
OUT4_P  (via drill 0.35)
  Top 0.152: v17.75,15.88 18.38,15.88 19,16.5 IC3.2
  Bottom 0.152: v17.75,15.88 18.75,14.88 18.75,8 17.75,7 17.75,6.73 SV2.5
OUT5_N  (via drill 0.35)
  Top 0.152: v23.62,13.12 24,13.12 24,15.75 23.88,15.88 22,15.88 22,15.5 21.12,14.62 16.88,14.62 16.88,19.62 18.25,21 18.38,21 19,21.62 IC3.6
  Bottom 0.152: v23.62,13.12 24.25,12.5 24.25,7.88 25.25,6.88 25.25,6.73 SV2.11
OUT5_P  (via drill 0.35)
  Top 0.152: v17.5,22.88 18.12,23.5 18.38,23.5 19,24.12 IC3.8 | v16.88,12.88 16.88,10 16.62,9.75 16.62,7.75 21.62,7.75 22.79,6.59 SV2.9
  Bottom 0.152: v17.5,22.88 16.88,22.25 v16.88,12.88
OUT6_N  (via drill 0.35)
  Top 0.152: v28.38,21 27.12,22.25 9.62,22.25 9,22.88 IC3.14
  Bottom 0.152: v28.38,21 29,20.38 29,8.25 30.25,7 30.25,6.73 SV2.15
OUT6_P  (via drill 0.25, 0.35)
  Top 0.152: v7.38,17.65 7.38,24.98 7.8,25.4 8.96,25.4 IC3.12 | v27.8,4.6 27.45,4.95 11.37,4.95 10.97,5.35 10.97,11.71 v6.9,15.78
  Bottom 0.152: v7.38,17.65 6.9,17.18 v6.9,15.78 | v27.8,4.6 27.8,6.66 SV2.13
OUT7_N  (via drill 0.35)
  Top 0.152: v12.38,12.75 12.38,17.12 9.88,19.62 9.62,19.62 9,20.25 IC3.16 | v11.5,11.28 11.5,5.25 34,5.25 SV2.19
  Bottom 0.152: v11.5,11.28 12.38,12.15 v12.38,12.75
OUT7_P  (via drill 0.35)
  Top 0.152: v11.75,15.25 9.88,17.12 9.62,17.12 9,17.75 IC3.18 | v14.25,12.62 14.25,10.5 15.38,10.5 16.25,9.62 16.25,5.62 31.88,5.62 32.98,6.73 SV2.17
  Bottom 0.152: v11.75,15.25 14.25,12.75 v14.25,12.62
OUT23_EN  (via drill 0.35)
  Top 0.152: v26,28.25 26,31.12 27.65,32.77 IC2.31 | v24.38,21.62 23,21.62 IC4.15
  Bottom 0.152: v26,28.25 24.38,26.62 v24.38,21.62
OUT45_EN  (via drill 0.35)
  Top 0.152: v24.75,28.25 25,28.25 25,30.62 27.59,33.21 27.62,33.25 27.8,33.42 IC2.30 | v20.38,20.25 19,20.25 IC3.5
  Bottom 0.152: v24.75,28.25 20.38,23.88 v20.38,20.25
OUT67_EN  (via drill 0.35)
  Top 0.152: v20.62,28.25 20.62,31.38 23.02,33.77 23.12,33.88 23.32,34.08 IC2.29 | v14,21.62 9,21.62 IC3.15
  Bottom 0.152: v14,21.62 v20.62,28.25
OUT_3V0
  Top 0.152: IC5.1 42.92,27.52 43.07,27.67 43.62,27.67 44.92,28.98 IC2.45
OUT_3V1
  Top 0.152: IC5.3 41.62,27.82 42.09,28.3 42.4,28.3 42.84,28.73 44.13,28.73 44.27,28.88 IC2.44
OUT_3V2
  Top 0.152: IC5.4 40.98,28.18 41.4,28.6 42.27,28.6 42.71,29.04 43.4,29.04 43.62,29.26 IC2.43
OUT_3V3
  Top 0.152: IC2.38 40.38,26.97 IC5.5
OUT_3V4
  Top 0.152: IC2.37 39.73,26.97 IC5.6
OUT_3V5
  Top 0.152: IC2.36 39.08,26.97 IC5.7
OUT_3V6
  Top 0.152: IC5.8 38.38,29.9 IC2.35
OUT_3V7
  Top 0.152: IC2.34 37.77,26.97 IC5.9
OUTPUT0
  Top 0.152: IC4.1 33,15.38 37.54,15.38 42.66,20.49 42.66,20.81 IC5.20
OUTPUT1
  Top 0.152: IC5.18 41.62,21.12 41.62,22.88 36.25,22.88 33.75,25.38 33,25.38 IC4.9
OUTPUT2
  Top 0.152: IC5.17 40.88,21.12 40.88,22.5 36.12,22.5 33.75,24.88 27.88,24.88 26.12,26.62 23,26.62 IC4.11
OUTPUT3
  Top 0.152: IC4.19 23,16.62 23.25,16.88 31.12,16.88 31.55,17.3 33.84,17.3 33.98,17.43 33.98,18.7 34.35,19.07 39.75,19.07 40.06,19.38 40.06,20.81 IC5.16
OUTPUT4
  Top 0.152: IC5.15 39.62,21 39.62,19.38 34.12,19.38 33.88,19.62 30.88,19.62 30,18.75 26.38,18.75 25.88,18.25 25.25,18.25 23.88,19.62 18.12,19.62 18,19.5 18,17.12 19.88,17.12 20,17 20,15.38 19,15.38 IC3.1
OUTPUT5  (via drill 0.35)
  Top 0.152: v36.38,21.88 39,21.88 39,21.12 IC5.14 | v36.5,23.5 33.88,26.12 27.12,26.12 26,27.25 21,27.25 19.25,25.5 19,25.5 IC3.9
  Bottom 0.152: v36.38,21.88 36.5,22 v36.5,23.5
OUTPUT6  (via drill 0.35)
  Top 0.152: v38.38,20 38.38,21 IC5.13 | v37.62,23.5 33.5,27.62 9.88,27.62 9,26.75 IC3.11
  Bottom 0.152: v38.38,20 37.62,20.75 v37.62,23.5
OUTPUT7
  Top 0.152: IC5.12 37.62,21 37.62,20.25 35.88,20.25 33.75,22.38 29.88,22.38 26.25,26 21,26 19.75,24.75 11,24.75 9.75,23.5 8.22,23.5 7.68,22.96 7.68,18.1 7.91,17.87 7.91,17.09 8.45,16.55 IC3.19
SPI_MISO
  Top 0.152: SV3.21 38.09,46.91 38.48,46.91 41.02,44.37 IC2.10
SPI_MOSI
  Top 0.152: SV3.19 35.85,46.61 38.14,46.61 40.38,44.37 IC2.11
SPI_SCK
  Top 0.152: IC2.5 44.27,44.75 44.78,45.26 44.78,47.75 42.73,49.8 37.6,49.8 36.31,51.09 SV3.23
STATUS0
  Top 0.152: IC2.55 50.54,36.02 52.7,33.87 52.7,32.67 53.4,31.97 53.4,30.6 53.6,30.4 R1.1
STATUS1
  Top 0.152: IC2.56 50.33,36.67 53,34 53,32.8 53.2,32.6 R2.1
STATUS2
  Top 0.152: IC2.54 50.76,35.38 52.39,33.75 52.39,32.55 53.09,31.84 53.09,30.47 53.4,30.17 53.4,28.4 53.6,28.2 R3.1
VCORE
  Top 0.152: R4.1 21,44.84
  Top 0.305: 23.4,44.75 C12.1 27.59,44.75 C8.+ 32.58,43.88 32.78,43.68 35.52,43.68 36.6,42.6 42.2,42.6 | 23.4,44.75 C11.1 | 42.2,42.6 42.33,42.73 IC2.8 42.33,45.02 C5.1 | IC2.41 42.33,30.93 45.1,33.7 | 45.1,33.7 45.8,34.4 45.8,39.8 43,42.6 42.2,42.6 | 45.1,33.7 49.54,29.26 C2.1 | IC1.5 21,44.84 23.31,44.84 23.4,44.75

### Text on the board
tNames: VCORE Good | Rev 01 | (c) 2018 Tristan Seifert | Lichtenstein 8 Channel / Differential Multiplexer